# Altium schematic sheet QSPI FLASH.SchDoc: QSPI FLASH
size A4; SheetNumber: 2; SheetSize: A4; Time: 11
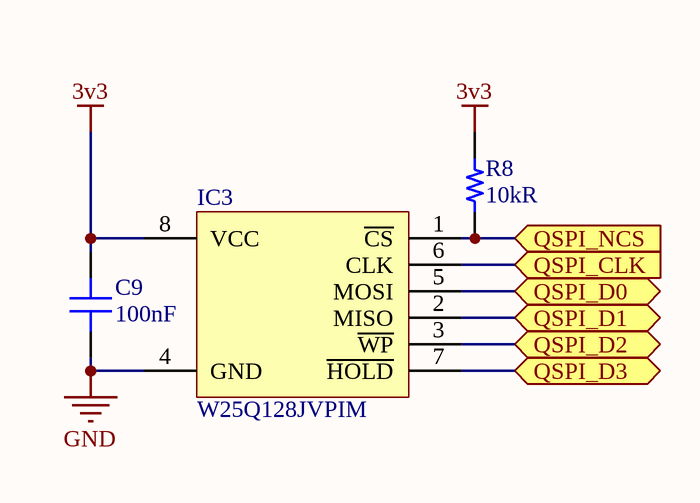
[diagram p0: QSPI FLASH.SchDoc]

## Parts
C9  100nF  [CAP 0603/1608]
IC3  W25Q128JVPIM  [WINBOND WSON-8 6x5mm]
R8  10kR  [RES 0603/1608]

## Ports
QSPI_CLK (in), QSPI_D0 (bidir), QSPI_D1 (bidir), QSPI_D2 (bidir), QSPI_D3 (bidir), QSPI_NCS (in)

## Nets
3v3: C9.1 IC3.8(VCC) R8.2
GND: C9.2 IC3.4(GND)
QSPI_CLK: IC3.6(CLK) ; port QSPI_CLK
QSPI_D0: IC3.5(MOSI) ; port QSPI_D0
QSPI_D1: IC3.2(MISO) ; port QSPI_D1
QSPI_D2: IC3.3(~{WP}) ; port QSPI_D2
QSPI_D3: IC3.7(~{HOLD}) ; port QSPI_D3
QSPI_NCS: IC3.1(~{CS}) R8.1 ; port QSPI_NCS

## Notes on the sheet
- Title:
- Size:
- Project:
- Revision:
- Sheet
- of
- Date:
- YıLDıZ IoT
- Elperek Mahallesi
- Saray Sokak, No:12
- SAKARYA / TURKEY
- File:

## Library data of the parts
C9 = Capacitor - Ceramic: Ceramic, SMT Capacitor; Manufacturer: Samsung; Manufacturer Part Number: CL10B104JB8NNNC; Tolerance: 5%; Voltage Rating: 50V; Dielectric: X7R; Supplier 1: Digi-Key; Supplier Part Number 1: 1276-1033-1-ND; Stock 1: 305374; Pricing 1: 1 = 0,10000, 10 = 0,04800, 100 = 0,02160, 500 = 0,01540, 1000 = 0,01210 (USD); RoHS: Yes; Mount: Surface Mount; Case/Package: 0603; Case Code (Metric): 1608; Case Code (Imperial): 0603; Material: Ceramic; Contact Plating: Tin; Min Operating Temperature: -55°C; Max Operating Temperature: 125°C; Packaging: Tape and Reel; Package Quantity: 1; Capacitance: 100nF; Voltage: 50V; Length: 1.6mm; Height: 0.8mm; Width: 0.031inch; Thickness: 0.035inch; Depth: 0.8mm; Radiation Hardening: No; ComponentLink1URL: https://datasheet.ciiva.com/25793/cl10b104jb8nnnc-25793394.pdf?src-supplier=Digi-Key; ComponentLink1Description: https://datasheet.ciiva.com/25793/cl10b104jb8nnnc-25793394.pdf?src-supplier=Digi-Key; ComponentLink2URL: https://datasheet.ciiva.com/26838/getdatasheetpartid-359321-26838402.pdf?src-supplier=Verical; ComponentLink2Description: https://datasheet.ciiva.com/26838/getdatasheetpartid-359321-26838402.pdf?src-supplier=Verical; ComponentLink3URL: https://datasheet.ciiva.com/16498/cl10b104jb8nnnc-16498485.pdf?src-supplier=Future+Electronics; ComponentLink3Description: https://datasheet.ciiva.com/16498/cl10b104jb8nnnc-16498485.pdf?src-supplier=Future+Electronics; ComponentLink4URL: https://datasheet.ciiva.com/29199/456613-da-01-en-vs-kondensator-0603-29199008.pdf?src-supplier=Conrad; ComponentLink4Description: https://datasheet.ciiva.com/29199/456613-da-01-en-vs-kondensator-0603-29199008.pdf?src-supplier=Conrad
IC3 = WINBOND FLASH SPI 8PIN: Supplier 1: Digi-Key; Supplier Part Number 1: W25Q128JVPIM-ND; Manufacturer: Winbond; Manufacturer Part Number: W25Q128JVPIM; Stock 1: 3127; Pricing 1: 1 = 1,47000, 10 = 1,34200, 25 = 1,30640, 50 = 1,29940, 100 = 1,16150, 250 = 1,15808, 500 = 1,14084, 1000 = 1,09189, 5000 = 1,01675 (USD); RoHS: No; ComponentLink1URL: http://www.winbond.com/resource-files/w25q128jv_dtr%20revc%2003272018%20plus.pdf?src-supplier=Digi-Key; ComponentLink1Description: http://www.winbond.com/resource-files/w25q128jv_dtr%20revc%2003272018%20plus.pdf?src-supplier=Digi-Key
R8 = Resistor_Chip: Ceramic, SMT Capacitor; Manufacturer: Stackpole Electronics; Manufacturer Part Number: RNCP0603FTD10K0; Tolerance: 1%; Max Power Dissipation: 125mW; Temperature Coefficient: 100ppm/°C; Supplier 1: Digi-Key; Supplier Part Number 1: RNCP0603FTD10K0CT-ND; Stock 1: 619664; Pricing 1: 1 = 0,10000, 10 = 0,06700, 100 = 0,02730, 1000 = 0,01224, 2500 = 0,01063 (USD); RoHS: Yes; Mount: Surface Mount; Case/Package: 0603; Case Code (Metric): 1608; Case Code (Imperial): 0603; Contact Plating: Tin,Matte; Min Operating Temperature: -55°C; Max Operating Temperature: 155°C; Packaging: Tape and Reel; Resistance: 10kR; Composition: Thin Film; Number of Terminations: 2; Features: Moisture Resistant,Anti-Sulfur; Length: 0.059inch; Height: 0.02inch; Width: 0.031inch; Radiation Hardening: No; Lead Free: Lead Free; ComponentLink1URL: https://www.seielect.com/Catalog/SEI-rncp.pdf?src-supplier=Avnet; ComponentLink1Description: https://www.seielect.com/Catalog/SEI-rncp.pdf?src-supplier=Avnet; ComponentLink2URL: https://www.seielect.com/catalog/SEI-Packaging.pdf?src-supplier=Digi-Key; ComponentLink2Description: https://www.seielect.com/catalog/SEI-Packaging.pdf?src-supplier=Digi-Key; ComponentLink3URL: https://www.seielect.com/Catalog/SEI-rncp.pdf?src-supplier=Digi-Key; ComponentLink3Description: https://www.seielect.com/Catalog/SEI-rncp.pdf?src-supplier=Digi-Key